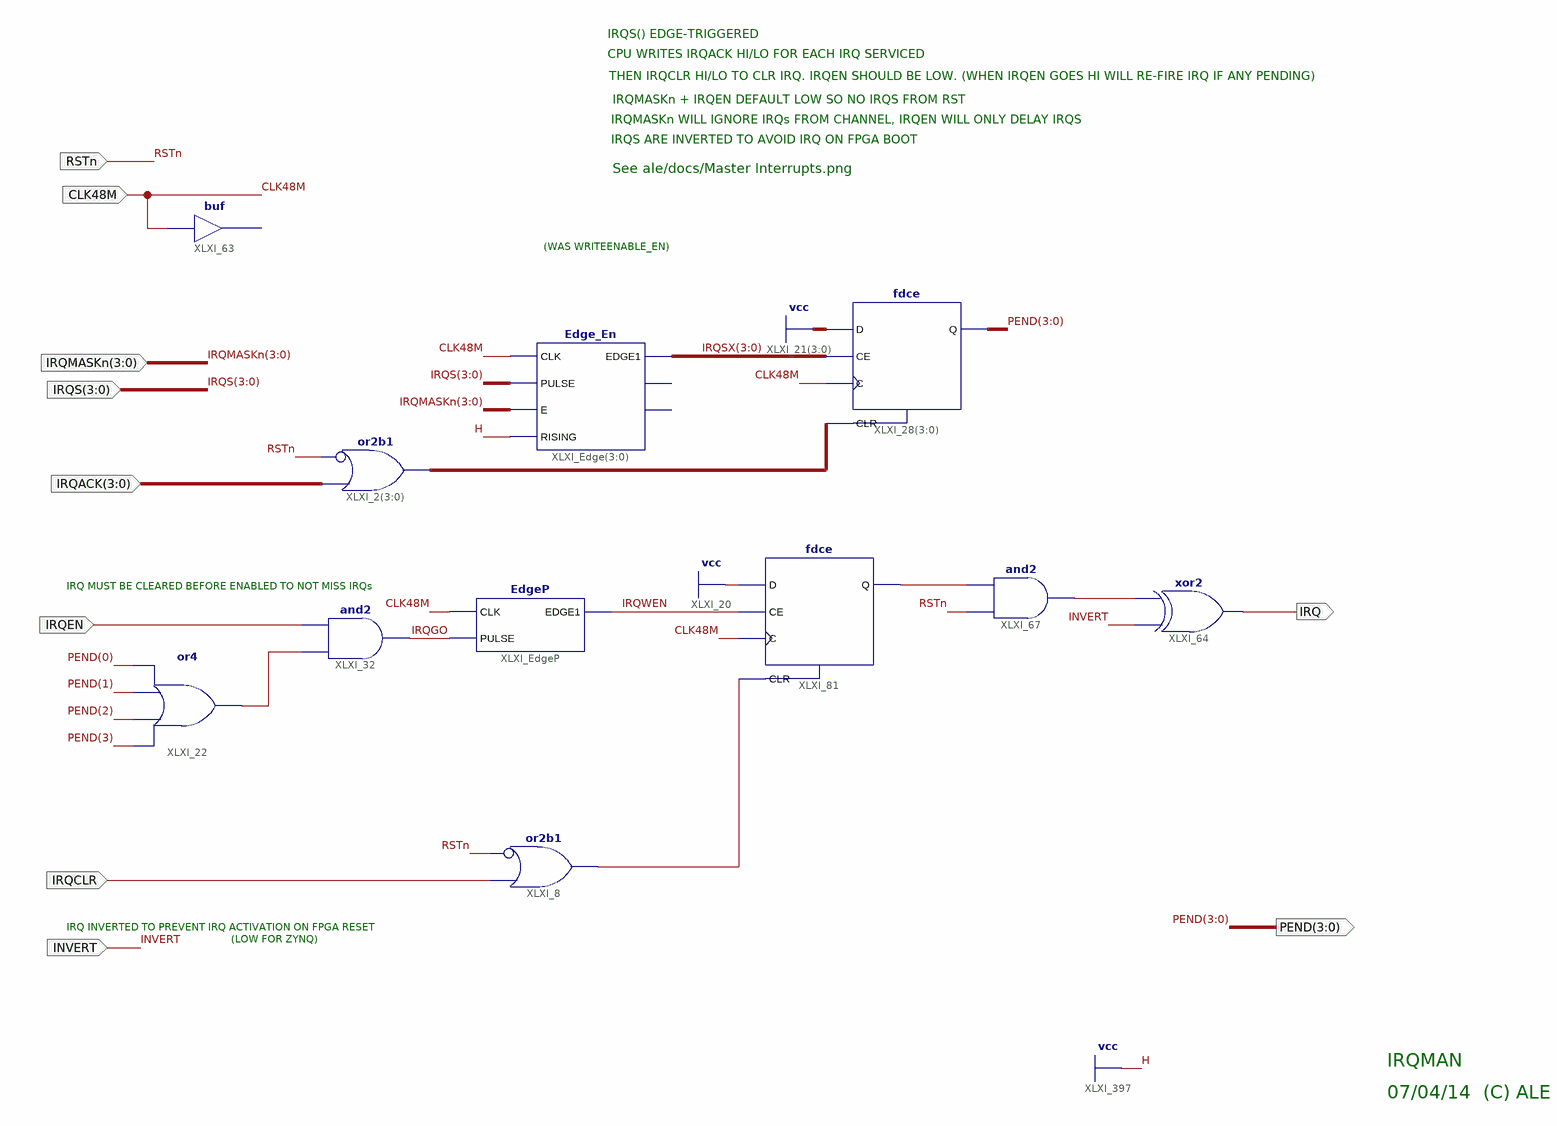
[diagram p0: schematic sheet 1]
// Xilinx ISE schematic IrqMan.sch (zynq) as structural Verilog: 11 symbols, 10 ports
module IrqMan (
  input  RSTn,
  input  CLK48M,
  input  [3:0] IRQS,
  input  [3:0] IRQMASKn,
  input  INVERT,
  input  [3:0] IRQACK,
  input  IRQEN,
  input  IRQCLR,
  output [3:0] PEND,
  output IRQ
);

  wire IRQGO, IRQWEN, XLXN_11, XLXN_13, XLXN_168, XLXN_169;
  wire [3:0] IRQSX, XLXN_184;

  fdce XLXI_28[3:0] (.C(CLK48M), .CE(IRQSX), .CLR(XLXN_184), .D(4'b1111), .Q(PEND));
  assign XLXN_184 = ~{4{RSTn}} | IRQACK;  // or2b1 XLXI_2[3..0], 4 bits wide
  and XLXI_32 (IRQGO, XLXN_11, IRQEN);
  xor XLXI_64 (IRQ, INVERT, XLXN_169);
  and XLXI_67 (XLXN_169, RSTn, XLXN_168);
  fdce XLXI_81 (.C(CLK48M), .CE(IRQWEN), .CLR(XLXN_13), .D(1'b1), .Q(XLXN_168));
  or XLXI_22 (XLXN_11, PEND[3], PEND[2], PEND[1], PEND[0]);
  // buf XLXI_63 has open pins: I=CLK48M, O=open
  or XLXI_8 (XLXN_13, ~RSTn, IRQCLR);  // or2b1
  EdgeP XLXI_EdgeP (.CLK(CLK48M), .EDGE1(IRQWEN), .PULSE(IRQGO));
  Edge_En XLXI_Edge[3:0] (
    .CLK(CLK48M), .E(IRQMASKn), .EDGE1(IRQSX), .PULSE(IRQS), .RISING(1'b1));  // open: EDGE0, EDGEQUICK

  // Notes on the sheet:
  //   IRQS() EDGE-TRIGGERED
  //   CPU WRITES IRQACK HI/LO FOR EACH IRQ SERVICED
  //   THEN IRQCLR HI/LO TO CLR IRQ. IRQEN SHOULD BE LOW. (WHEN IRQEN GOES HI WILL RE-FIRE IRQ IF ANY PENDING)
  //   IRQMASKn + IRQEN DEFAULT LOW SO NO IRQS FROM RST
  //   IRQMASKn WILL IGNORE IRQs FROM CHANNEL, IRQEN WILL ONLY DELAY IRQS
  //   IRQS ARE INVERTED TO AVOID IRQ ON FPGA BOOT
  //   See ale/docs/Master Interrupts.png
  //   (WAS WRITEENABLE_EN)
  //   IRQ MUST BE CLEARED BEFORE ENABLED TO NOT MISS IRQs
  //   IRQ INVERTED TO PREVENT IRQ ACTIVATION ON FPGA RESET
  //   (LOW FOR ZYNQ)
  //   IRQMAN
  //   07/04/14  (C) ALE
endmodule
